# EAGLE design Noise-box-v001 (EAGLE 6.6.0)
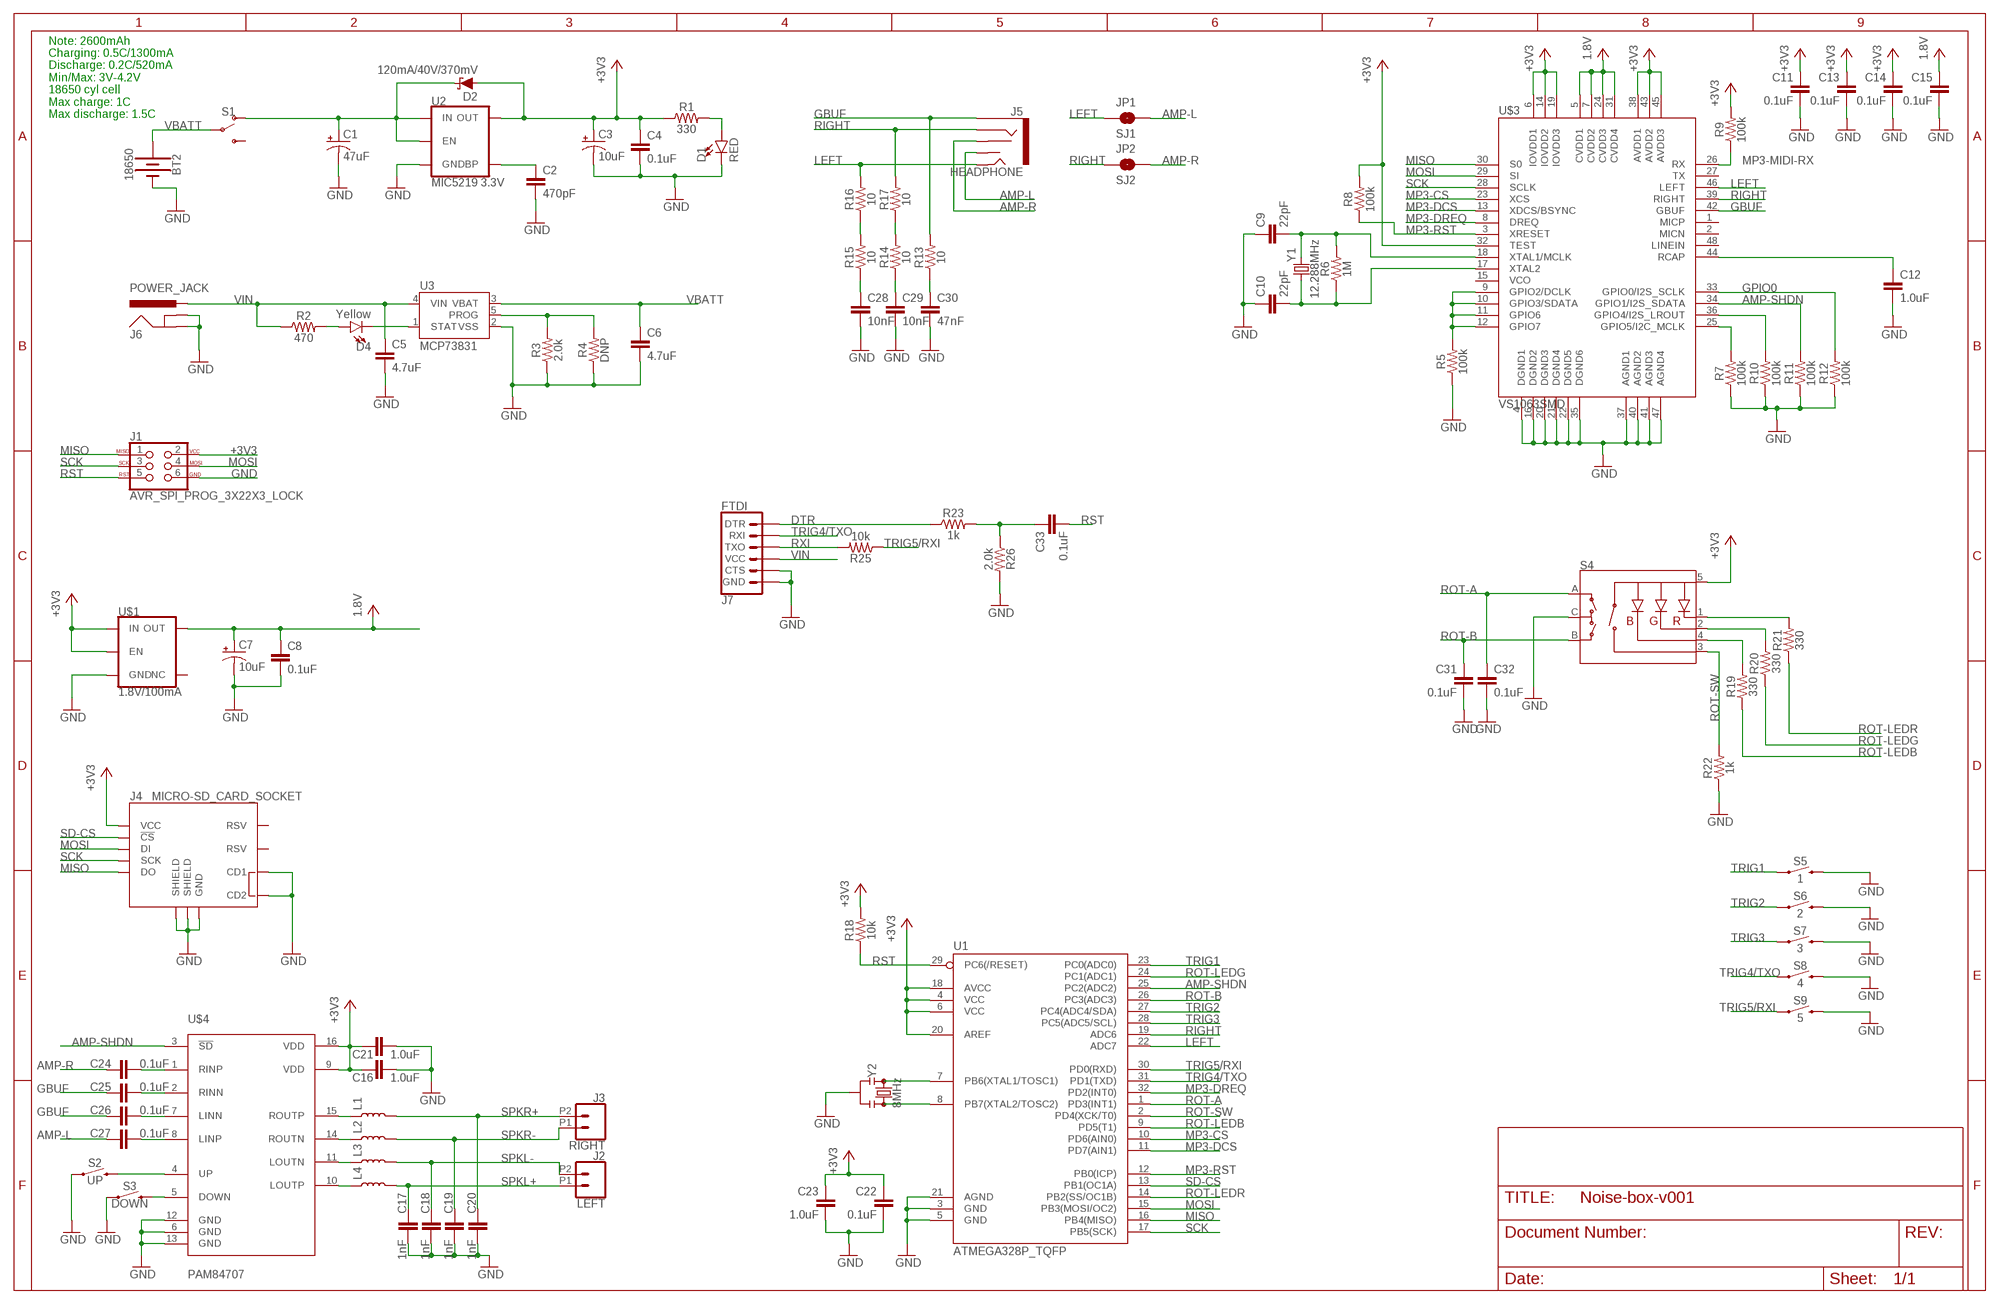
[diagram p0: schematic, sheet 1]

## Parts
BT2  18650  BATTERY-1043P  [BATTERY_18650-1043P]
C1  47uF  47UF-POLAR-EIA3528-10V-10%  [EIA3528]
C2  470pF  470PF-0603-50V-5%  [0603]
C3  10uF  10UF-POLAR-EIA3216-16V-10%(TANT)  [EIA3216]
C4  0.1uF  0.1UF-0603-25V-5%  [0603]
C5  4.7uF  4.7UF0603  [0603]
C6  4.7uF  4.7UF0603  [0603]
C7  10uF  10UF-POLAR-EIA3216-16V-10%(TANT)  [EIA3216]
C8  0.1uF  0.1UF-0603-25V-5%  [0603]
C9  22pF  22PF-0603-50V-5%  [0603]
C10  22pF  22PF-0603-50V-5%  [0603]
C11  0.1uF  0.1UF-0603-25V-5%  [0603]
C12  1.0uF  1.0UF-0603-16V-10%  [0603]
C13  0.1uF  0.1UF-0603-25V-5%  [0603]
C14  0.1uF  0.1UF-0603-25V-5%  [0603]
C15  0.1uF  0.1UF-0603-25V-5%  [0603]
C16  1.0uF  1.0UF-0603-16V-10%  [0603]
C17  1nF  1.0NF/1000PF-0603-50V-10%  [0603]
C18  1nF  1.0NF/1000PF-0603-50V-10%  [0603]
C19  1nF  1.0NF/1000PF-0603-50V-10%  [0603]
C20  1nF  1.0NF/1000PF-0603-50V-10%  [0603]
C21  1.0uF  1.0UF-0603-16V-10%  [0603]
C22  0.1uF  0.1UF-0603-25V-5%  [0603]
C23  1.0uF  1.0UF-0603-16V-10%  [0603]
C24  0.1uF  0.1UF-0603-25V-5%  [0603]
C25  0.1uF  0.1UF-0603-25V-5%  [0603]
C26  0.1uF  0.1UF-0603-25V-5%  [0603]
C27  0.1uF  0.1UF-0603-25V-5%  [0603]
C28  10nF  10NF-0603-50V-10%  [0603]
C29  10nF  10NF-0603-50V-10%  [0603]
C30  47nF  47NF-0603-25V-5%  [0603]
C31  0.1uF  0.1UF-0603-25V-5%  [0603]
C32  0.1uF  0.1UF-0603-25V-5%  [0603]
C33  0.1uF  0.1UF-0603-25V-5%  [0603]
D1  RED  LED-RED0603  [LED-0603]
D2  120mA/40V/370mV  DIODE-SCHOTTKY-RB751S40  [SOD-523]
D4  Yellow  LED-YELLOW0603  [LED-0603]
J1  AVR_SPI_PROG_3X22X3_LOCK  [2X3_LOCK]
J2  LEFT  CONN_022.54MM_SCREWTERM  [1X02_2.54_SCREWTERM]
J3  RIGHT  CONN_022.54MM_SCREWTERM  [1X02_2.54_SCREWTERM]
J4  MICRO-SD_CARD_SOCKET  [MICRO-SD-SOCKET]
J5  HEADPHONE  AUDIO_JACK_3.5MM_SMD  [AUDIO-JACK-3.5MM-SMD]
J6  POWER_JACK  [POWER_JACK_PTH]
J7  FTDI  6_PIN_SERIAL_TARGETSILK  [6_PIN_SERIAL_TARGET_SIDE_W_SILK]
JP1  SJ1  JUMPER-SMT_2_NO_SILK  [SMT-JUMPER_2_NO_SILK]
JP2  SJ2  JUMPER-SMT_2_NO_SILK  [SMT-JUMPER_2_NO_SILK]
L1  INDUCTOR-0805-3.3UH  [0805]
L2  INDUCTOR-0805-3.3UH  [0805]
L3  INDUCTOR-0805-3.3UH  [0805]
L4  INDUCTOR-0805-3.3UH  [0805]
R1  330  330OHM-0603-1/10W-1%  [0603]
R2  470  470OHM-0603-1/10W-1%  [0603]
R3  2.0k  2.0KOHM-0603-1/10W-5%  [0603]
R4  DNP  2.0KOHM-0603-1/10W-5%  [0603]
R5  100k  100KOHM-0603-1/10W-1%  [0603]
R6  1M  1MOHM-0603-1/4W-5%  [0603]
R7  100k  100KOHM-0603-1/10W-1%  [0603]
R8  100k  100KOHM-0603-1/10W-1%  [0603]
R9  100k  100KOHM-0603-1/10W-1%  [0603]
R10  100k  100KOHM-0603-1/10W-1%  [0603]
R11  100k  100KOHM-0603-1/10W-1%  [0603]
R12  100k  100KOHM-0603-1/10W-1%  [0603]
R13  10  10OHM-0603-1/10W-5%  [0603]
R14  10  10OHM-0603-1/10W-5%  [0603]
R15  10  10OHM-0603-1/10W-5%  [0603]
R16  10  10OHM-0603-1/10W-5%  [0603]
R17  10  10OHM-0603-1/10W-5%  [0603]
R18  10k  10KOHM-0603-1/10W-1%  [0603]
R19  330  330OHM-0603-1/10W-1%  [0603]
R20  330  330OHM-0603-1/10W-1%  [0603]
R21  330  330OHM-0603-1/10W-1%  [0603]
R22  1k  1KOHM-0603-1/10W-1%  [0603]
R23  1k  1KOHM-0603-1/10W-1%  [0603]
R25  10k  10KOHM-0603-1/10W-1%  [0603]
R26  2.0k  2.0KOHM-0603-1/10W-5%  [0603]
S1  SWITCH-SPDT-SMD-RIGHT-ANGLE  [SWITCH_SPST_SMD_A]
S2  UP  MOMENTARY-SWITCH-SPST-SMD-4.5MM  [TACTILE_SWITCH_SMD_4.5MM]
S3  DOWN  MOMENTARY-SWITCH-SPST-SMD-4.5MM  [TACTILE_SWITCH_SMD_4.5MM]
S4  ENCODER-RGB-SWITCH  [ENCODER_LED_3]
S5  1  MOMENTARY-SWITCH-SPST-SMD-4.5MM  [TACTILE_SWITCH_SMD_4.5MM]
S6  2  MOMENTARY-SWITCH-SPST-SMD-4.5MM  [TACTILE_SWITCH_SMD_4.5MM]
S7  3  MOMENTARY-SWITCH-SPST-SMD-4.5MM  [TACTILE_SWITCH_SMD_4.5MM]
S8  4  MOMENTARY-SWITCH-SPST-SMD-4.5MM  [TACTILE_SWITCH_SMD_4.5MM]
S9  5  MOMENTARY-SWITCH-SPST-SMD-4.5MM  [TACTILE_SWITCH_SMD_4.5MM]
U1  ATMEGA328P_TQFP  [TQFP32-08]
U2  MIC5219 3.3V  V_REG_MIC52193.3V  [SOT23-5]
U3  MCP73831  [SOT23-5]
U$1  1.8V/100mA  V_REG_SP6214-1.8V  [SC70]
U$3  VS1063SMD  [LQFP-48]
U$4  PAM84707  PAM8407  [SO16]
Y1  12.288MHz  CRYSTAL-12.288MHZ"  [CRYSTAL-SMD-5X3.2-4PAD]
Y2  8MHz  RESONATOR-8MHZSMD_3.2X1.3  [RESONATOR-SMD-3.2X1.3]

## Nets
+3V3: C3.+ C4.1 C11.1 C13.1 C14.1 C16.1 C21.1 C22.1 C23.1 D2.A J1.2 J4.VCC R1.1 R8.2 R9.2 R18.2 S4.5(+) U1.4(VCC) U1.6(VCC) U1.18(AVCC) U1.20(AREF) U2.5(OUT) U$1.1(IN) U$1.3(EN) U$3.6(IOVDD1) U$3.14(IOVDD2) U$3.19(IOVDD3) U$3.32(TEST) U$3.38(AVDD1) U$3.43(AVDD2) U$3.45(AVDD3) U$4.9(VDD) U$4.16(VDD)
AMP-L: C27.1 J5.TSH JP1.2
AMP-R: C24.1 J5.RSH JP2.2
AMP-SHDN: R11.2 U1.25(PC2(ADC2)) U$3.34(GPIO1/I2S_SDATA) U$4.3(!SD)
DTR: J7.P$1(DTR) R23.1
GBUF: C25.1 C26.1 J5.SLEEVE R13.2 U$3.42(GBUF)
GND: BT2.GND@1(-) C1.C(-) C2.2 C3.- C4.2 C5.2 C6.2 C7.- C8.2 C9.1 C10.1 C11.2 C12.2 C13.2 C14.2 C15.2 C16.2 C17.2 C18.2 C19.2 C20.2 C21.2 C22.2 C23.2 C28.2 C29.2 C30.2 C31.2 C32.2 D1.C J1.6 J4.CD1 J4.CD2 J4.GND J4.GND1(SHIELD) J4.GND3(SHIELD) J6.GND J6.GNDBREAK J7.P$5(CTS) J7.P$6(GND) R3.1 R4.1 R5.1 R7.1 R10.1 R11.1 R12.1 R22.1 R26.2 S2.2 S2.3 S3.2 S3.3 S4.C S5.1 S5.4 S6.1 S6.4 S7.1 S7.4 S8.1 S8.4 S9.1 S9.4 U1.3(GND) U1.5(GND) U1.21(AGND) U2.2(GND) U3.2(VSS) U$1.2(GND) U$3.4(DGND1) U$3.16(DGND2) U$3.20(DGND3) U$3.21(DGND4) U$3.22(DGND5) U$3.35(DGND6) U$3.37(AGND1) U$3.40(AGND2) U$3.41(AGND3) U$3.47(AGND4) U$4.6(GND) U$4.12(GND) U$4.13(GND) Y2.2
GPIO0: R12.2 U$3.33(GPIO0/I2S_SCLK)
LEFT: J5.TIP JP1.1 R16.2 U1.22(ADC7) U$3.46(LEFT)
MISO: J1.1 J4.DO U1.16(PB4(MISO)) U$3.30(S0)
MOSI: J1.4 J4.DI U1.15(PB3(MOSI/OC2)) U$3.29(SI)
MP3-CS: U1.10(PD6(AIN0)) U$3.23(XCS)
MP3-DCS: U1.11(PD7(AIN1)) U$3.13(XDCS/BSYNC)
MP3-DREQ: U1.32(PD2(INT0)) U$3.8(DREQ)
MP3-MIDI-RX: R9.1 U$3.26(RX)
MP3-RST: R8.1 U1.12(PB0(ICP)) U$3.3(XRESET)
N$1: D4.A R2.2
N$2: C2.1 U2.4(BP)
N$3: D1.A R1.2
N$4: R3.2 R4.2 U3.5(PROG)
N$5: U1.7(PB6(XTAL1/TOSC1)) Y2.1
N$6: R5.2 U$3.9(GPIO2/DCLK) U$3.10(GPIO3/SDATA) U$3.11(GPIO6) U$3.12(GPIO7)
N$7: D4.C U3.1(STAT)
N$8: U1.8(PB7(XTAL2/TOSC2)) Y2.3
N$9: L1.1 U$4.15(ROUTP)
N$10: L2.1 U$4.14(ROUTN)
N$11: L3.1 U$4.11(LOUTN)
N$12: L4.1 U$4.10(LOUTP)
N$13: C28.1 R15.1
N$14: R7.2 U$3.25(GPIO5/I2C_MCLK)
N$15: R10.2 U$3.36(GPIO4/I2S_LROUT)
N$16: C29.1 R14.1
N$17: C9.2 R6.2 U$3.18(XTAL1/MCLK) Y1.3
N$18: C10.2 R6.1 U$3.17(XTAL2) Y1.1
N$19: C30.1 R13.1
N$20: R15.2 R16.1
N$21: C12.1 U$3.44(RCAP)
N$22: R14.2 R17.1
N$24: C24.2 U$4.1(RINP)
N$26: C33.1 R23.2 R26.1
N$29: R19.2 S4.4(-B)
N$30: R20.2 S4.2(-G)
N$31: R21.2 S4.1(-R)
N$34: C25.2 U$4.2(RINN)
N$35: C26.2 U$4.7(LINN)
N$42: C27.2 U$4.8(LINP)
N$43: S3.1 S3.4 U$4.5(DOWN)
N$44: S2.1 S2.4 U$4.4(UP)
N$45: C1.A(+) D2.C S1.1(O) U2.1(IN) U2.3(EN)
RIGHT: J5.RING JP2.1 R17.2 U1.19(ADC6) U$3.39(RIGHT)
ROT-A: C32.1 S4.A U1.1(PD3(INT1))
ROT-B: C31.1 S4.B U1.26(PC3(ADC3))
ROT-LEDB: R19.1 U1.9(PD5(T1))
ROT-LEDG: R20.1 U1.24(PC1(ADC1))
ROT-LEDR: R21.1 U1.14(PB2(SS/OC1B))
ROT-SW: R22.2 S4.3(SW) U1.2(PD4(XCK/T0))
RST: C33.2 J1.5 R18.1 U1.29(PC6(/RESET))
RXI: J7.P$2(TXO) R25.2
SCK: J1.3 J4.SCLK(SCK) U1.17(PB5(SCK)) U$3.28(SCLK)
SD-CS: J4.CS(!CS) U1.13(PB1(OC1A))
SPKL+: C17.1 J2.P1 L4.2
SPKL-: C18.1 J2.P2 L3.2
SPKR+: C20.1 J3.P2 L1.2
SPKR-: C19.1 J3.P1 L2.2
TRIG1: S5.2 S5.3 U1.23(PC0(ADC0))
TRIG2: S6.2 S6.3 U1.27(PC4(ADC4/SDA))
TRIG3: S7.2 S7.3 U1.28(PC5(ADC5/SCL))
TRIG4/TXO: J7.P$3(RXI) S8.2 S8.3 U1.31(PD1(TXD))
TRIG5/RXI: R25.1 S9.2 S9.3 U1.30(PD0(RXD))
VBATT: BT2.PWR@1(+) C6.1 S1.2(P) U3.3(VBAT)
VCC: C7.+ C8.1 C15.1 U$1.5(OUT) U$3.5(CVDD1) U$3.7(CVDD2) U$3.24(CVDD3) U$3.31(CVDD4) ; supply symbol labelled 1.8V
VIN: C5.1 J6.PWR J7.P$4(VCC) R2.1 U3.4(VIN)
Unconnected: J4.RSV1(RSV) J4.RSV2(RSV) S1.3(S) U$1.4(NC) U$3.1(MICP) U$3.2(MICN) U$3.15(VCO) U$3.27(TX) U$3.48(LINEIN)

## Notes on the sheet
- Note: 2600mAh
  Charging: 0.5C/1300mA
  Discharge: 0.2C/520mA
  Min/Max: 3V-4.2V
  18650 cyl cell
  Max charge: 1C
  Max discharge: 1.5C

## Library data of the parts
BT2 = MAK:BATTERY: Battery - Single Cell A variety of battery chemistries, sizes, and footprints. Device List: 20MM_PTH - Coin Cell Battery Holder - 20mm (PTH) <https://www.sparkfun.com/products/783> 12MM_SMD - Coin Cell Battery Holder - 12mm (SMD) <https://www.sparkfun.com/products/10592> 12MM_PTH - Coin Cell Battery Holder - 12mm (PTH) <https://www.sparkfun.com/products/7948> 20MM_SMD - 20mm Coin Cell Battery Holder (SMD) (2 legs) Used on the Big Time Watch Kit <https://www.sparkfun.com/products/11734> 20MM_SMD_4LEGS - Coin Cell Battery Holder - 20mm (SMD) <https://www.sparkfun.com/products/11892> 20MM_SMD_4LEGS_OVERPASTE - Coin Cell Battery Holder - 20mm (SMD) <https://www.sparkfun.com/products/11892> (Over-paste on the legs) 24.5MM_PTH - Coin Cell Battery Holder - 24.5mm (PTH) <https://www.sparkfun.com/products/8863> 9V - 9V Battery Holder - PC Mount Used on the SparkFun SparkPunk Sound Kit <https://www.sparkfun.com/products/11177> and SparkFun SparkPunk Sequencer Kit <https://www.sparkfun.com/products/12707> 18650 - Battery Holder - 18650 (PTH) <https://www.sparkfun.com/products/13113> AA - Battery Holder - 1xAA (PTH) <https://www.sparkfun.com/products/7949> AAA - Battery Holder - 1xAAA (PTH) <https://www.sparkfun.com/products/12718> AA_KIT - Battery Holder - 1xAA (PTH) <https://www.sparkfun.com/products/7949> Special kit package - pads only have exposed copper on one side of the board. AAA_KIT - Battery Holder - 1xAAA (PTH) <https://www.sparkfun.com/products/12718> Special kit package - pads only have exposed copper on one side of the board.; MANUFACTURER: keystone electronics; PARTNO: 1043p
C1 = SparkFun-Capacitors:47UF-POLAR: 47µF polarized capacitors A capacitor is a passive two-terminal electrical component used to store electrical energy temporarily in an electric field.; PROD_ID: CAP-08310
C2 = SparkFun-Capacitors:470PF: 470pF ceramic capacitors A capacitor is a passive two-terminal electrical component used to store electrical energy temporarily in an electric field.; PROD_ID: CAP-07884
C3 C7 = SparkFun-Capacitors:10UF-POLAR: 10.0µF polarized capacitors A capacitor is a passive two-terminal electrical component used to store electrical energy temporarily in an electric field.; PROD_ID: CAP-00811
C4 C8 C11 C13-C15 C22 C24-C27 C31-C33 = SparkFun-Capacitors:0.1UF: 0.1µF ceramic capacitors A capacitor is a passive two-terminal electrical component used to store electrical energy temporarily in an electric field.; PROD_ID: CAP-08604
C5 C6 = SparkFun-Capacitors:4.7UF: 4.7µF ceramic capacitors A capacitor is a passive two-terminal electrical component used to store electrical energy temporarily in an electric field.; PROD_ID: CAP-08280
C9 C10 = SparkFun-Capacitors:22PF: 22pF ceramic capacitors A capacitor is a passive two-terminal electrical component used to store electrical energy temporarily in an electric field.; PROD_ID: CAP-07876
C12 C16 C21 C23 = SparkFun-Capacitors:1.0UF: 1µF ceramic capacitors A capacitor is a passive two-terminal electrical component used to store electrical energy temporarily in an electric field.; PROD_ID: CAP-00868
C17-C20 = SparkFun-Capacitors:1.0NF/1000PF: 1nF/1,000pF ceramic capacitors A capacitor is a passive two-terminal electrical component used to store electrical energy temporarily in an electric field.; PROD_ID: CAP-07886
C28 C29 = SparkFun-Capacitors:10NF: 0.01uF/10nF/10,000pF ceramic capacitors A capacitor is a passive two-terminal electrical component used to store electrical energy temporarily in an electric field. CAP-09321; PROD_ID: CAP-00867
C30 = SparkFun-Capacitors:47NF: 47nF ceramic capacitors A capacitor is a passive two-terminal electrical component used to store electrical energy temporarily in an electric field.; PROD_ID: CAP-08605
D1 = SparkFun-LED:LED-RED: Red SMD LED Used in manufacturing of most products at SparkFun Packages: 0603 - SMD 0603 package [Product Link] <http://docs.avagotech.com/docs/AV02-0551EN> 0603 SMART - SMD 0603 SMART package ( more efficient and expensive)[Product Link] <http://www.osram-os.com/Graphics/XPic2/00077099_0.pdf> 1206 - SMD1206 package [Product Link] <https://www.sparkfun.com/datasheets/DevTools/LilyPad/Q150OVS4.pdff> SparkFun Products: Pro Mini 328 -5V <https://www.sparkfun.com/products/821> RedBoard <https://www.sparkfun.com/products/12757> IOIO-OTG <https://www.sparkfun.com/products/13613>; PROD_ID: DIO-00819
D2 = SparkFun-DiscreteSemi:DIODE-SCHOTTKY: Schottky diode A Schottky diode is a semiconductor diode which has a low forward voltage drop and a very fast switching action.; PROD_ID: DIO-11018
D4 = SparkFun-LED:LED-YELLOW: Yellow SMD LED Used in manufacturing several products at SparkFun. Packages: 0603 - SMD 0603 package[Product Link] <http://www.kingbrightusa.com/product.asp?catalog_name=LED&product_id=APT1608SYCK> 0603 -SMART - SMART SMD 0603 package (more efficient/more expensive) [Product Link] <http://www.osram-os.com/osram_os/en/products/product-catalog/led-light-emitting-diodes/smartled-0603/ly-l29k/index.jsp> LilyPad - SMD1206 package[Product Datasheet] <https://www.sparkfun.com/datasheets/DevTools/LilyPad/Q150YUS4.pdf> SparkFun Products: Blynk Board <https://www.sparkfun.com/products/13794> IOIO-OTG <https://www.sparkfun.com/products/13613> XBee Explorer Serial <https://www.sparkfun.com/products/13225>; PROD_ID: DIO-09003
J1 = SparkFun-Connectors:AVR_SPI_PROG_3X2: AVR ISP 6 Pin This is the reduced ISP connector for AVR programming. Common on Arduino. This footprint will take up less PCB space and can be used with a 10-pin to 6-pin adapter such as SKU: BOB-08508 **Special note about "TEST_POINT" package. The stop mask is on the top side, so if you want your programming test points to be on the bottom of your board, make sure to place this package on the bottom side of the board. This also ensure that the orientation to program from the bottom side will be correct. SparkFun Products: SparkFun ISP Pogo Adapter <https://www.sparkfun.com/products/11591> - NS Tiny AVR Programmer <https://www.sparkfun.com/products/11801> -PTH
J2 J3 = SparkFun-Connectors:CONN_02: Multi connection point. Often used as Generic Header-pin footprint for 0.1 inch spaced/style header connections On any of the 0.1 inch spaced packages, you can populate with these: Break Away Headers - Straight <https://www.sparkfun.com/products/116> (PRT-00116) Break Away Male Headers - Right Angle <https://www.sparkfun.com/products/553> (PRT-00553) Female Headers <https://www.sparkfun.com/products/115> (PRT-00115) Break Away Headers - Machine Pin <https://www.sparkfun.com/products/117> (PRT-00117) Break Away Female Headers - Swiss Machine Pin <https://www.sparkfun.com/products/743> (PRT-00743) For SCREWTERMINALS and SPRING TERMINALS visit here: Screw Terimnals on SparkFun.com <https://www.sparkfun.com/search/results?term=Screw+Terminals> (5mm/3.5mm/2.54mm spacing) This device is also useful as a general connection point to wire up your design to another part of your project. Our various solder wires solder well into these plated through hole pads. Hook-Up Wire - Assortment (Stranded, 22 AWG) <https://www.sparkfun.com/products/11375> (PRT-11375) Hook-Up Wire - Assortment (Solid Core, 22 AWG) <https://www.sparkfun.com/products/11367> (PRT-11367) View the entire wire category on our website here <https://www.sparkfun.com/categories/141> Special notes: Molex polarized connector foot print use with: PRT-08233 with associated crimp pins and housings. 2.54_SCREWTERM for use with PRT-10571. 3.5mm Screw Terminal footprints for PRT-08084 5mm Screw Terminal footprints for use with PRT-08432
J4 = SparkFun-Connectors:MICRO-SD_CARD_SOCKET: microSD Socket for Transflash Push-push type µSD socket. tDoc lines correctly indicate media card edge positions when inserting (unlocked, locked, depressed). NOTE: CD1 and CD2 are connected internally, and the default detect state of the socket is detect pin to ground. SparkFun Products: WAV Trigger <https://www.sparkfun.com/products/13660> CAN-Bus Shield <https://www.sparkfun.com/products/13262> SparkFun Level Shifing microSD Breakout <https://www.sparkfun.com/products/13743>; PROD_ID: CONN-07820; SF_ID: PRT-00127
J5 = SparkFun-Connectors:AUDIO_JACK_3.5MM: Audio Jack 3.5mm variants of PTH and SMT stereo audio jack with bypass switches. SparkFun Products: SparkFun SparkPunk Sound Kit <[https://www.sparkfun.com/products/11177]> - PTH MP3 Trigger <https://www.sparkfun.com/products/13720> -3.5mm SMD SparkFun PicoBoard <https://www.sparkfun.com/products/11888>- 2.5mm SMD; PROD_ID: CONN-10353
J6 = SparkFun-Connectors:POWER_JACK: Power Jack Connector This is the standard 5.5mm barrel jack for power. The PTH is the most common, proven, reliable, footprint. The Slot footprint only works if the mill layer is transmitted to the PCB fab house so be warned. Here are the connectors we sell at SparkFun: DC Barrel Power Jack/Connector <https://www.sparkfun.com/products/119> (PRT-00119) DC Barrel Power Jack/Connector (SMD) <https://www.sparkfun.com/products/12748> (PRT-12748) DC Barrel Jack Adapter - Breadboard Compatible <https://www.sparkfun.com/products/10811> (PRT-10811) It is used on this SparkFun product (and many, many others): SparkFun RedBoard - Programmed with Arduino <https://www.sparkfun.com/products/12757> (DEV-12757) Also, if you need a mating power supply or connector, please check these out: Wall Adapter Power Supply - 9VDC 650mA <https://www.sparkfun.com/products/298> (TOL-00298) DC Barrel Jack Adapter - Male <https://www.sparkfun.com/products/10287> (PRT-10287); PROD_ID: CONN-08197
J7 = SparkFun-Connectors:6_PIN_SERIAL_TARGET: 6-pin header connection for use with the "FTDI BASIC" pinout - TARGET SIDE. Also known as "Arduino Serial Program Header". It is used to mate with our FTDI Basic serial programmers using the Arduino IDE. Note, this device has "TARGET" in the name. It is intended to be used on a design that contains a target micro-controller that you wish to program. The "sister" device, named "CABLE" is inteneded to be used on a design that usually lives on the end of your USB cable and prvides the converter chip (FTDI232 or FTDI231x) to commnicate serial RX/TX. You can populate with some of these: Break Away Headers - Straight <https://www.sparkfun.com/products/116> (PRT-00116) For reference (or to suit your programming needs) check out these designs: SparkFun FTDI Basic Breakout - 5V <https://www.sparkfun.com/products/9716> (DEV-09716) SparkFun FTDI Basic Breakout - 3.3V <https://www.sparkfun.com/products/9873> (DEV-09873) SparkFun FTDI SmartBasic <https://www.sparkfun.com/products/12935> (DEV-12935) SparkFun Beefy 3 - FTDI Basic Breakout <https://www.sparkfun.com/products/13746> (DEV-13746)
JP1 JP2 = SparkFun-Jumpers:JUMPER-SMT_2_NO: Normally open jumper This jumper has two pads in close proximity to each other. Apply solder to close the connection. Round pads are easier to solder for beginners, but are a lot larger. SparkFun Product that uses the round pads: SparkFun EL Sequencer <https://www.sparkfun.com/products/12781>
L1-L4 = SparkFun-Coils:INDUCTOR: Inductors Resist changes in electrical current. Basically a coil of wire. SparkFun Products: SparkFun Load Cell Amplifier - HX711 <https://www.sparkfun.com/products/13879> IOIO-OTG - V2.2 <https://www.sparkfun.com/products/13613>; PROD_ID: NDUC-13076; VALUE: 3.3µH/±20%/450mA
R1 R19-R21 = SparkFun-Resistors:330OHM: 330Ω resistor A resistor is a passive two-terminal electrical component that implements electrical resistance as a circuit element. Resistors act to reduce current flow, and, at the same time, act to lower voltage levels within circuits. - Wikipedia; PROD_ID: RES-00818
R2 = SparkFun-Resistors:470OHM: 470Ω resistor A resistor is a passive two-terminal electrical component that implements electrical resistance as a circuit element. Resistors act to reduce current flow, and, at the same time, act to lower voltage levels within circuits. - Wikipedia; PROD_ID: RES-07869
R3 R26 = SparkFun-Resistors:2.0KOHM: 2kΩ resistor A resistor is a passive two-terminal electrical component that implements electrical resistance as a circuit element. Resistors act to reduce current flow, and, at the same time, act to lower voltage levels within circuits. - Wikipedia; PROD_ID: RES-08296
R4 = SparkFun-Resistors:2.0KOHM: 2kΩ resistor A resistor is a passive two-terminal electrical component that implements electrical resistance as a circuit element. Resistors act to reduce current flow, and, at the same time, act to lower voltage levels within circuits. - Wikipedia; PROD_ID: RES-08296; VALUE: 2.0k
R5 R7-R12 = SparkFun-Resistors:100KOHM: 100kΩ resistor A resistor is a passive two-terminal electrical component that implements electrical resistance as a circuit element. Resistors act to reduce current flow, and, at the same time, act to lower voltage levels within circuits. - Wikipedia; PROD_ID: RES-07828
R6 = SparkFun-Resistors:1MOHM: 1MΩ resistor A resistor is a passive two-terminal electrical component that implements electrical resistance as a circuit element. Resistors act to reduce current flow, and, at the same time, act to lower voltage levels within circuits. - Wikipedia; PROD_ID: RES-07868
R13-R17 = SparkFun-Resistors:10OHM: 10Ω resistor A resistor is a passive two-terminal electrical component that implements electrical resistance as a circuit element. Resistors act to reduce current flow, and, at the same time, act to lower voltage levels within circuits. - Wikipedia; PROD_ID: RES-09834
R18 R25 = SparkFun-Resistors:10KOHM: 10kΩ resistor A resistor is a passive two-terminal electrical component that implements electrical resistance as a circuit element. Resistors act to reduce current flow, and, at the same time, act to lower voltage levels within circuits. - Wikipedia; PROD_ID: RES-00824
R22 R23 = SparkFun-Resistors:1KOHM: 1kΩ resistor A resistor is a passive two-terminal electrical component that implements electrical resistance as a circuit element. Resistors act to reduce current flow, and, at the same time, act to lower voltage levels within circuits. - Wikipedia; PROD_ID: RES-07856
S1 = SparkFun-Switches:SWITCH-SPDT: Single Pole, Double Throw (SPDT) Switch Single-pole, double-throw (SPDT) switch. Variant Overview SMD-AYZ0202 Surface Mount DPDT Switch <https://www.sparkfun.com/products/597> (COM-00597) Used on e.g. LilyPad Arduino USB - ATmega32U4 Board <https://www.sparkfun.com/products/12049> PTH-11.6X4.0MM SPDT Mini Power Switch <https://www.sparkfun.com/products/102> (COM-00102) Used on e.g. SparkFun Simon Says - Through-Hole Soldering Kit <https://www.sparkfun.com/products/10547> (KIT-10547) PTH-11.6X4.0MM-KIT KIT version of SPDT Mini Power Switch - Simplifies soldering by removing tStop of switch pins - only one side can be soldered. PTH-11.6X4.0MM-LOCK LOCK version of SPDT Mini Power Switch - Offset pins hold switch in place for easier soldering. SMD-RIGHT-ANGLE Surface Mount Right Angle Switch <https://www.sparkfun.com/products/10860> (COM-10860) Used on e.g. SparkFun ESP8266 Thing <https://www.sparkfun.com/products/13231>; PROD_ID: SWCH-10651; SF_SKU: COM-10860
S2 S3 S5-S9 = SparkFun-Switches:MOMENTARY-SWITCH-SPST: Momentary Switch (Pushbutton) - SPST Normally-open (NO) SPST momentary switches (buttons, pushbuttons). Variants PTH-12MM - 12mm square, through-hole Momentary Pushbutton Switch - 12mm Square <https://www.sparkfun.com/products/9190> (COM-09190) PTH-6.0MM, PTH-6.0MM-KIT - 6.0mm square, through-hole Mini Pushbutton Switch <https://www.sparkfun.com/products/97> (COM-00097) KIT package intended for soldering kit's - only one side of pads' copper is exposed. PTH-RIGHT-ANGLE-KIT - Right-angle, through-hole Right Angle Tactile Button <https://www.sparkfun.com/products/10791> - Used on SparkFun BigTime Watch Kit <https://www.sparkfun.com/products/11734> SMD-12MM - 12mm square, surface-mount Tactile Button - SMD (12mm) <https://www.sparkfun.com/products/12993> (COM-12993) Used on SparkFun PicoBoard <https://www.sparkfun.com/products/11888> SMD-4.5MM - 4.5mm Square Trackball Switch Used on SparkFun Blackberry Trackballer Breakout <https://www.sparkfun.com/products/13169> SMD-4.6MMX2.8MM - 4.60mm x 2.80mm, surface mount Used on SparkFun SAMD21 Mini Breakout <https://www.sparkfun.com/products/13664> SMD-5.2MM, SMD-5.2-REDUNDANT - 5.2mm square, surface-mount Mini Pushbutton Switch - SMD <https://www.sparkfun.com/products/8720> (COM-08720) Used on Arduino Pro Mini <https://www.sparkfun.com/products/11114> REDUNDANT package connects both switch circuits together SMD-6.0X3.5MM - 6.0 x 3.5mm, surface mount Momentary Reset Switch SMD <https://www.sparkfun.com/products/8229> (COM-08229) SMD-6.2MM-TALL - 6.2mm square, surface mount Tactile Button - SMD (6mm) <https://www.sparkfun.com/products/12992> Used on SparkFun Digital Sandbox <https://www.sparkfun.com/products/12651> SMD-RIGHT-ANGLE - Right-angle, surface mount Used on SparkFun Block for Intel® Edison - Arduino <https://www.sparkfun.com/products/13036>; PROD_ID: SWCH-09213
S4 = SparkFun-Switches:ENCODER-RGB-SWITCH: Illuminated Rotary Encoder w/ RGB LED and select switch Encoders rotate similarly to potentiometers, but they’re different from potentiometers in that an encoder has full rotation without limits. They output gray code so that you can tell how much and in which direction the encoder has been turned. This encoder includes an RGB LED and a push-down select switch. Part #: Top Up EC12PLRGBSDVBF-D <http://top-up.so-buy.com/front/bin/ptdetail.phtml?Part=EC12PLRGBSDVBF-D> SparkFun Products Rotary Encoder - Illuminated (RGB) <https://www.sparkfun.com/products/10982> (COM-10982); PROD_ID: RES-10859; SF_SKU: COM-10982
U1 = SparkFun-IC-Microcontroller:ATMEGA328P_TQFP: Popular 328P in QFP Storefront component: ATmega328 - TQFP <https://www.sparkfun.com/products/13448> (COM-13448) Datasheet <http://www.sparkfun.com/datasheets/Components/SMD/ATMega328.pdf> SparkFun Products SparkFun RedBoard - Programmed with Arduino <https://www.sparkfun.com/products/12757> (DEV-12757) Arduino Pro Mini 328 - 5V/16MHz <https://www.sparkfun.com/products/11113> (DEV-11113) Arduino Pro Mini 328 - 3.3V/8MHz <https://www.sparkfun.com/products/11114> (DEV-11114) SparkFun OpenLog <https://www.sparkfun.com/products/13712> (DEV-13712) SparkFun MicroView - OLED Arduino Module <https://www.sparkfun.com/products/12923> (DEV-12923) SparkFun Digital Sandbox <https://www.sparkfun.com/products/12651> (DEV-12651) SparkFun PicoBoard <https://www.sparkfun.com/products/11888> (WIG-11888) Arduino Fio <https://www.sparkfun.com/products/10116> (DEV-10116) LilyPad Arduino 328 Main Board <https://www.sparkfun.com/products/13342> (DEV-13342) SparkFun RedStick <https://www.sparkfun.com/products/13741> (DEV-13741) LilyPad MP3 <https://www.sparkfun.com/products/11013> (DEV-11013) LilyPad Arduino SimpleSnap <https://www.sparkfun.com/products/10941> (DEV-10941) SparkFun Stepoko <https://www.sparkfun.com/products/13899> (ROB-13899) SparkFun Geiger Counter <https://www.sparkfun.com/products/11345> (SEN-11345) SparkFun EL Sequencer <https://www.sparkfun.com/products/12781> (COM-12781) Arduino Pro 328 - 5V/16MHz <https://www.sparkfun.com/products/10915> (DEV-10915) CryptoCape <https://www.sparkfun.com/products/12773> (DEV-12773) SparkFun IR Thermometer Evaluation Board - MLX90614 <https://www.sparkfun.com/products/10740> (SEN-10740) SparkFun RedBot Mainboard <https://www.sparkfun.com/products/12097> (ROB-12097) Arduino Pro 328 - 3.3V/8MHz <https://www.sparkfun.com/products/10914> (DEV-10914) SparkFun Block for Intel® Edison - Arduino <https://www.sparkfun.com/products/13036> (DEV-13036) SparkFun Simon Says - Surface Mount Soldering Kit <https://www.sparkfun.com/products/10935> (KIT-10935) SparkFun 7-Segment Serial Display - Red <https://www.sparkfun.com/products/11441> (COM-11441) SparkFun 7-Segment Serial Display - White <https://www.sparkfun.com/products/11629> (COM-11629) SparkFun 7-Segment Serial Display - Yellow <https://www.sparkfun.com/products/11443> (COM-11443) SparkFun 7-Segment Serial Display - Kelly Green <https://www.sparkfun.com/products/11440> (COM-11440) SparkFun 7-Segment Serial Display - Blue <https://www.sparkfun.com/products/11442> (COM-11442) SparkFun OpenSegment Serial Display - 20mm (Blue) <https://www.sparkfun.com/products/11647> (COM-11647) SparkFun OpenSegment Serial Display - 20mm (Green) <https://www.sparkfun.com/products/11646> (COM-11646) SparkFun OpenSegment Serial Display - 20mm (White) <https://www.sparkfun.com/products/11648> (COM-11648) SparkFun OpenSegment Serial Display - 20mm (Red) <https://www.sparkfun.com/products/11644> (COM-11644) SparkFun OpenSegment Serial Display - 20mm (Yellow) <https://www.sparkfun.com/products/11645> (COM-11645) SparkFun OpenSegment Shield <https://www.sparkfun.com/products/13190> (DEV-13190); PROD_ID: IC-09069
U2 = SparkFun-IC-Power:V_REG_MIC5219: V_REG MIC5219 Standard 3.3V and 5V 500mA LDO voltage regulator in SOT-23 layout. Micrel part MIC5219. BP (by-pass) pin is used to lower output noise with 470pF cap, may be left open.; PROD_ID: VREG-09872
U3 = SparkFun-IC-Power:MCP73831: MCP73831T Li-Ion, Li-Pol Controller Miniature single cell, fully integrated Li-Ion, Li-polymer charge management controller Datasheet <http://ww1.microchip.com/downloads/en/DeviceDoc/20001984g.pdf> SparkFun Products: SparkFun ESP32 Thing <https://www.sparkfun.com/products/13907> SparkFun 9DoF Razor IMU M0 <https://www.sparkfun.com/products/14001>; PROD_ID: IC-09995
U$1 = SparkFun-IC-Power:V_REG_SP6214: Voltage Regulator - SP6214 SP6214 Series SC-70-5 Micropower SC-70 100 mA CMOS LDO Regulator Datasheet <https://www.exar.com/content/document.ashx?id=654> SparkFun Products: MP3 Trigger <https://www.sparkfun.com/products/13720> SparkFun Particle Sensor Breakout <https://www.sparkfun.com/products/14045>; PROD_ID: VREG-08428
U$3 = SparkFun-IC-Conversion:VS1063: MP3 and MIDI Codec - VS1063 AAC/MP3/WMA/MIDI/Ogg Audio Player and Ogg Recording Device LQFP-48 7x7x1.4 mm Datasheet <http://cdn.sparkfun.com/datasheets/Widgets/vs1063ds.pdf> SparkFun Products Storefront component: MP3 and MIDI Codec - VS1063 <https://www.sparkfun.com/products/11025> (COM-11025); PROD_ID: IC-10870
U$4 = RJC:PAM8407; PARTNO: PAM8407DRDICT-ND
Y1 = SparkFun-Clocks:CRYSTAL-12.288MHZ: 12.288MHz Crystal Digikey Example <http://www.digikey.com/product-detail/en/abracon-llc/ABM3B-12.288MHZ-B2-T/535-9117-1-ND/675634> Frequency: 12.288MHz Frequency Stability: ±50ppm Frequency Tolerance: ±20ppm Load Capacitance: 18pF SparkFun Products: MP3 Trigger <https://www.sparkfun.com/products/13720> SparkFun MP3 Player Shield <https://www.sparkfun.com/products/12660>; PROD_ID: XTAL-09653
Y2 = SparkFun-Clocks:RESONATOR-8MHZ: 8MHz Resonator Digikey Example <http://www.digikey.com/product-detail/en/murata-electronics-north-america/CSTCE10M0G55-R0/490-1196-1-ND/584633> Frequency: 8MHz Frequency Stability: ±0.2% Frequency Tolerance: ±0.5% Capacitance: 33pF SparkFun Products Arduino Pro Mini 328- 3.3V/8MHz <https://www.sparkfun.com/products/11114> SparkFun Digital Sandbox <https://www.sparkfun.com/products/12651>; PROD_ID: XTAL-08895

## Board
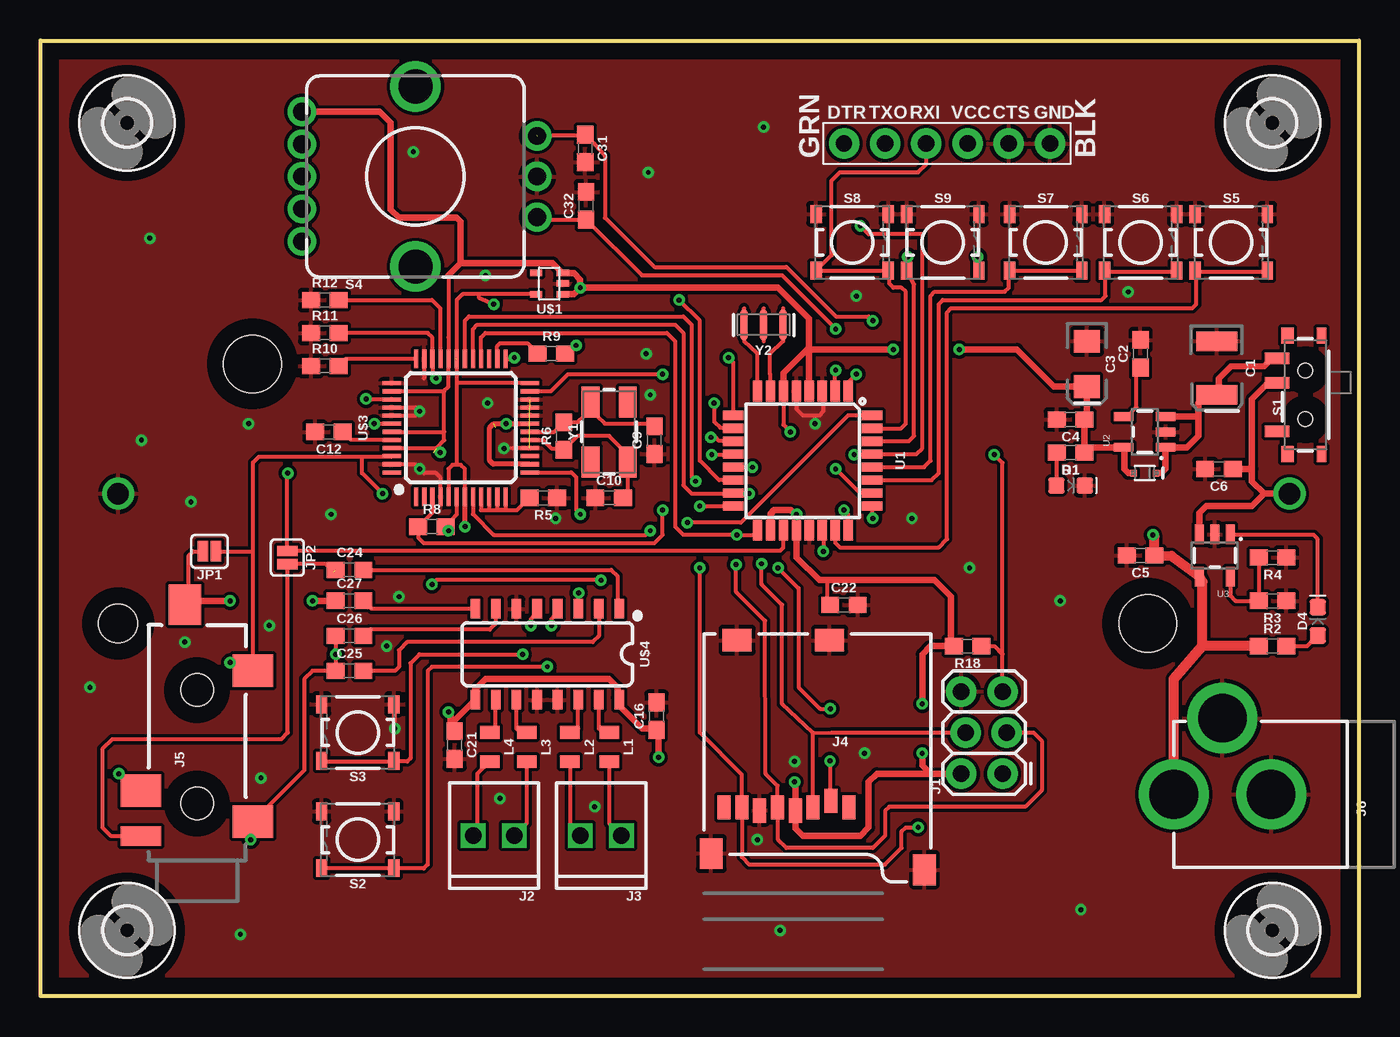
[diagram p1: board, top side]
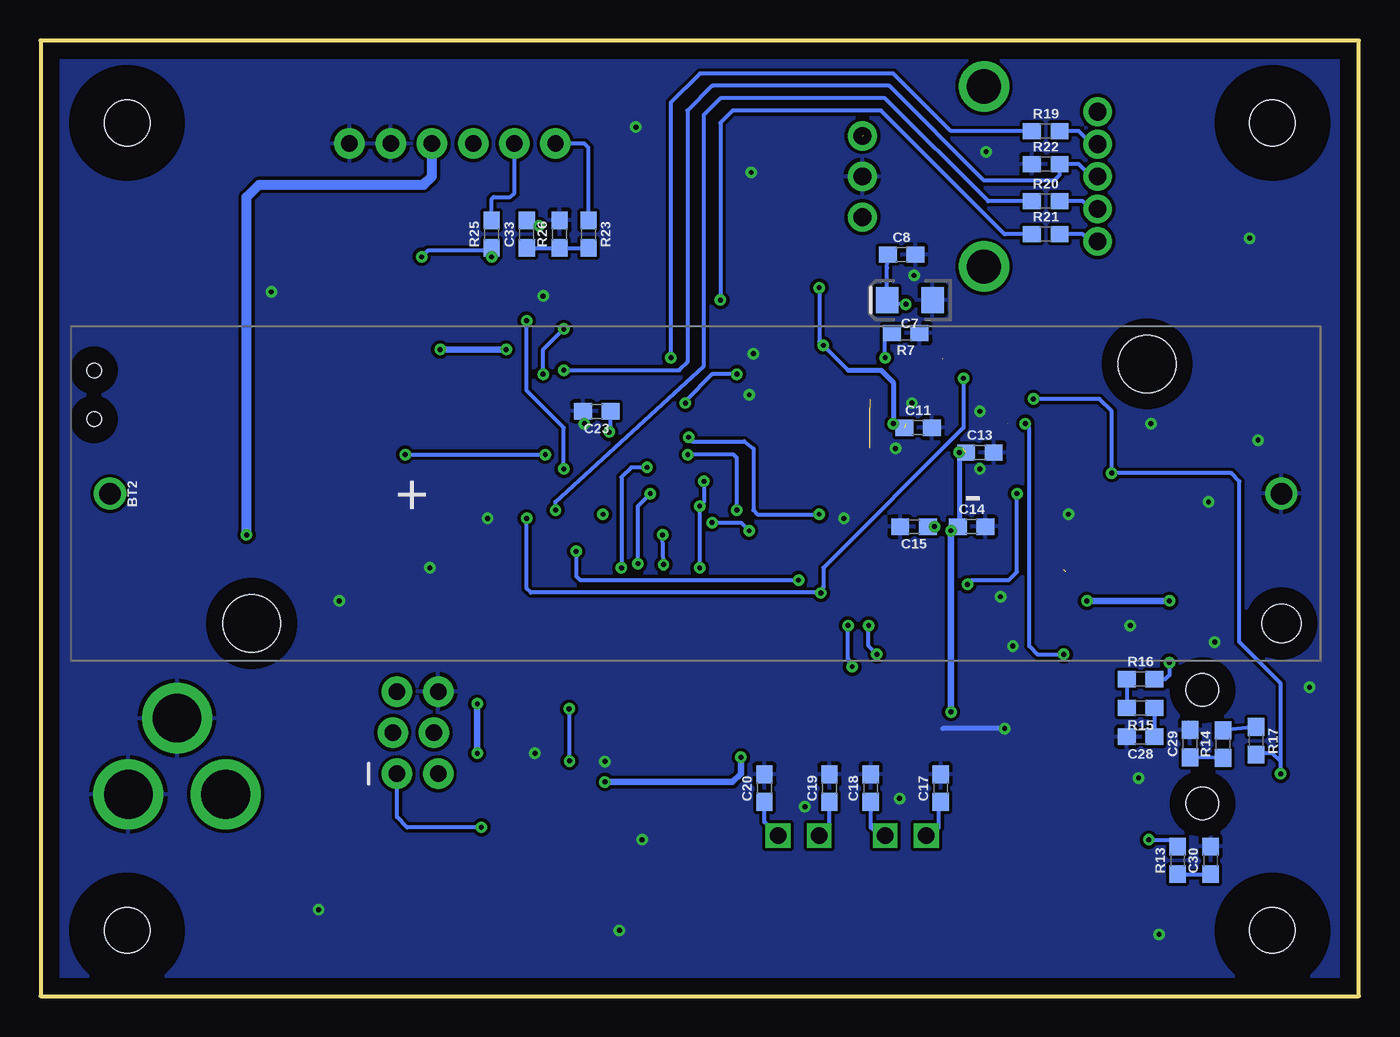
[diagram p2: board, bottom side, seen from below]

Size 81.28 x 58.93 mm. Coordinates in mm from the lower left corner, seen from the top.
Outline: 0,58.93 81.28,58.93 81.28,0 0,0 0,58.93
Copper layers (1*16): Top 0.035mm / dielectric 1.5mm / Bottom 0.035mm
Design rules "default": minimum track width 10mil, minimum drill 24mil, track to track 8mil, track to pad 8mil, pad to pad 8mil, via to via 8mil, smd to smd 8mil, copper to edge 40mil, drill to drill 8mil, minimum pad ring 10mil, minimum via ring 8mil, stop-mask expansion 4mil, vias tented up to drill 0mil, thermal gap 10mil

### Footprints (pad centres in the part's own frame; a part is rotated, then mirrored left to right if it is on the bottom)
BATTERY_18650-1043P = drill 1.32: GND@1 36.11,0; PWR@1 -36.11,0 | hole 3.55: -27.37,-8; 27.83,8 | hole 2.39: 36.11,-8
EIA3528 = smd 1.2 x 2.5: A 1.65,0; C -1.65,0
0603 = smd 1.1 x 1: 1 -0.85,0; 2 0.85,0
EIA3216 = smd 1.4 x 1.6: + 1.4,0; - -1.4,0
LED-0603 = smd 1 x 1: A -0.877,0; C 0.877,0
SOD-523 = smd 0.4 x 0.4: A -0.7,0; C 0.7,0
2X3_LOCK = drill 1.016 pad 1.88: 1 0,0.127; 2 0,2.667; 3 2.54,-0.127; 4 2.54,2.413; 5 5.08,0.127; 6 5.08,2.667
1X02_2.54_SCREWTERM = drill 1.016 square: P1 2.54,0; P2 0,0
MICRO-SD-SOCKET = smd 1.8 x 1.4: CD1 -2.05,0.4; CD2 -7.75,0.4 | smd 0.8 x 1.5: CS -7.84,10.3; DI -6.74,10.7; DO -2.34,10.7; GND -3.44,10.9; RSV1 -8.94,10.7; RSV2 -1.24,10.7; SCLK -4.54,10.7; VCC -5.64,10.9 | smd 1.4 x 1.9: GND1 -13.6,14.55; GND3 -0.45,13.55
AUDIO-JACK-3.5MM-SMD = smd 2 x 2.5: RING 4.3,3.45; SLEEVE 2.4,-3.45; TIP 11.7,-3.45 | smd 1.2 x 2.5: RSH 1.5,3.45 | smd 2.5 x 2: TSH 15.75,0.75 | hole 2: 3.5,0; 10.5,0
POWER_JACK_PTH = drill 2.997 pad 4.318: GND 0,7.7; GNDBREAK 4.7,10.7; PWR 0,13.7
6_PIN_SERIAL_TARGET_SIDE_W_SILK = drill 1.016 pad 1.88: P$1 -6.35,0; P$2 -3.81,0; P$3 -1.27,0; P$4 1.27,0; P$5 3.81,0; P$6 6.35,0
SMT-JUMPER_2_NO_SILK = smd 0.635 x 1.27: 1 -0.406,0; 2 0.406,0
0805 = smd 0.8 x 1.2: 1 -0.9,0; 2 0.9,0
SWITCH_SPST_SMD_A = smd 0.7 x 1.5: 1 -2.25,-1.75; 2 -0.75,-1.75; 3 2.25,-1.75 | smd 1 x 0.6: GND1 -3.65,1; GND3 3.65,1 | smd 1 x 0.8: GND2 -3.65,-1.1; GND4 3.65,-1.1 | hole 0.9: -1.5,0; 1.5,0
TACTILE_SWITCH_SMD_4.5MM = smd 0.7 x 1.1: 1 2.225,1.75; 2 2.225,-1.75; 3 -2.225,-1.75; 4 -2.225,1.75
ENCODER_LED_3 = drill 1.1 pad 1.778: 1 -4,7; 2 -2,7; 3 0,7; 4 2,7; 5 4,7 | drill 1.1 pad 1.8: A -2.5,-7.5; B 2.5,-7.5; C 0,-7.5 | drill 2.1: M1 -5.55,0; M2 5.55,0
TQFP32-08 = smd 1.27 x 0.559: 1 -4.293,2.8; 2 -4.293,2; 3 -4.293,1.2; 4 -4.293,0.4; 5 -4.293,-0.4; 6 -4.293,-1.2; 7 -4.293,-2; 8 -4.293,-2.8; 17 4.293,-2.8; 18 4.293,-2; 19 4.293,-1.2; 20 4.293,-0.4; 21 4.293,0.4; 22 4.293,1.2; 23 4.293,2; 24 4.293,2.8 | smd 0.559 x 1.27: 9 -2.8,-4.293; 10 -2,-4.293; 11 -1.2,-4.293; 12 -0.4,-4.293; 13 0.4,-4.293; 14 1.2,-4.293; 15 2,-4.293; 16 2.8,-4.293; 25 2.8,4.293; 26 2,4.293; 27 1.2,4.293; 28 0.4,4.293; 29 -0.4,4.293; 30 -1.2,4.293; 31 -2,4.293; 32 -2.8,4.293
SOT23-5 = smd 0.55 x 1.2: 1 -0.95,-1.3; 2 0,-1.3; 3 0.95,-1.3; 4 0.95,1.3; 5 -0.95,1.3
SC70 = smd 0.4 x 0.75: 1 -0.65,-0.825; 2 0,-0.825; 3 0.65,-0.825; 4 0.65,0.825; 5 -0.65,0.825
2,8 = hole 2.8: 0,0
LQFP-48 = smd 0.254 x 1.143: 1 -2.75,-4.25; 2 -2.25,-4.25; 3 -1.75,-4.25; 4 -1.25,-4.25; 5 -0.75,-4.25; 6 -0.25,-4.25; 7 0.25,-4.25; 8 0.75,-4.25; 9 1.25,-4.25; 10 1.75,-4.25; 11 2.25,-4.25; 12 2.75,-4.25; 25 2.75,4.25; 26 2.25,4.25; 27 1.75,4.25; 28 1.25,4.25; 29 0.75,4.25; 30 0.25,4.25; 31 -0.25,4.25; 32 -0.75,4.25; 33 -1.25,4.25; 34 -1.75,4.25; 35 -2.25,4.25; 36 -2.75,4.25 | smd 1.143 x 0.254: 13 4.25,-2.75; 14 4.25,-2.25; 15 4.25,-1.75; 16 4.25,-1.25; 17 4.25,-0.75; 18 4.25,-0.25; 19 4.25,0.25; 20 4.25,0.75; 21 4.25,1.25; 22 4.25,1.75; 23 4.25,2.25; 24 4.25,2.75; 37 -4.25,2.75; 38 -4.25,2.25; 39 -4.25,1.75; 40 -4.25,1.25; 41 -4.25,0.75; 42 -4.25,0.25; 43 -4.25,-0.25; 44 -4.25,-0.75; 45 -4.25,-1.25; 46 -4.25,-1.75; 47 -4.25,-2.25; 48 -4.25,-2.75
SO16 = smd 0.6 x 1.2: 1 -4.445,-2.8; 2 -3.175,-2.8; 3 -1.905,-2.8; 4 -0.635,-2.8; 5 0.635,-2.8; 6 1.905,-2.8; 7 3.175,-2.8; 8 4.445,-2.8; 9 4.445,2.8; 10 3.175,2.8; 11 1.905,2.8; 12 0.635,2.8; 13 -0.635,2.8; 14 -1.905,2.8; 15 -3.175,2.8; 16 -4.445,2.8
CRYSTAL-SMD-5X3.2-4PAD = smd 1.9 x 1.1: 1 -1.85,-1.15; 2 1.85,-1.15; 3 1.85,1.15; 4 -1.85,1.15
RESONATOR-SMD-3.2X1.3 = smd 0.45 x 1.905: 1 -1.2,0; 2 0,0; 3 1.2,0

### Placement (x,y rotation side)
BT2  40.89,30.99 0 bottom
C1  72.52,38.73 270 top
C2  67.82,39.62 90 top
C3  64.52,38.99 270 top
C4  63.5,35.56 180 top
C5  67.82,27.18 180 top
C6  72.64,32.51 180 top
C7  27.69,42.93 180 bottom
C8  28.19,45.72 0 bottom
C9  37.85,34.29 90 top
C10  35.05,30.73 0 top
C11  27.18,35.05 0 bottom
C12  17.78,34.8 180 top
C13  23.37,33.53 0 bottom
C14  23.88,28.96 0 bottom
C15  27.43,28.96 180 bottom
C16  37.97,17.27 90 top
C17  25.78,12.83 90 bottom
C18  30.1,12.83 90 bottom
C19  32.64,12.83 90 bottom
C20  36.65,12.83 90 bottom
C21  25.53,15.49 270 top
C22  49.53,24.13 0 top
C23  46.99,36.07 180 bottom
C24  19.05,26.29 0 top
C25  19.05,20.07 0 top
C26  19.05,22.23 0 top
C27  19.05,24.38 0 top
C28  13.46,16 180 bottom
C29  10.41,15.57 90 bottom
C30  9.14,8.38 90 bottom
C31  33.58,52.27 270 top
C32  33.63,48.74 90 top
C33  51.31,46.99 90 bottom
D1  63.5,31.5 0 top
D2  68.07,32.26 0 top
D4  78.74,23.11 90 top
J1  59.44,13.72 90 top
J2  29.21,9.91 180 top
J3  35.81,9.91 180 top
J4  40.89,22.35 180 top
J5  9.65,8.38 90 top
J6  83.57,12.45 90 top
J7  55.88,52.58 0 top
JP1  10.41,27.43 180 top
JP2  15.21,27.05 270 top
L1  35.05,15.37 270 top
L2  32.64,15.37 270 top
L3  29.97,15.37 270 top
L4  27.69,15.37 270 top
R1  63.5,33.53 180 top
R2  75.95,21.59 0 top
R3  75.95,24.38 180 top
R4  75.95,27.05 180 top
R5  30.99,30.73 180 top
R6  32.26,34.54 90 top
R7  27.94,40.89 180 bottom
R8  24.13,28.96 0 top
R9  31.5,39.62 0 top
R10  17.53,38.86 0 top
R11  17.53,40.89 0 top
R12  17.53,42.93 0 top
R13  11.18,8.38 90 bottom
R14  8.38,15.54 90 bottom
R15  13.46,17.78 180 bottom
R16  13.46,19.56 0 bottom
R17  6.35,15.75 270 bottom
R18  57.15,21.59 180 top
R19  19.3,53.34 0 bottom
R20  19.3,49.02 0 bottom
R21  19.3,46.99 0 bottom
R22  19.3,51.31 0 bottom
R23  47.5,46.99 270 bottom
R25  53.47,46.99 90 bottom
R26  49.28,46.99 90 bottom
S1  77.98,37.08 270 top
S2  19.56,9.65 180 top
S3  19.56,16.26 180 top
S4  23.11,50.55 90 top
S5  73.41,46.48 0 top
S6  67.82,46.48 0 top
S7  61.98,46.48 0 top
S8  50.04,46.48 0 top
S9  55.63,46.48 0 top
U1  46.99,33.02 270 top
U2  68.07,34.8 90 top
U3  72.39,27.18 180 top
U$1  31.37,43.94 90 top
U$2  [2,8]  75.95,53.85 0 top
U$3  25.91,35.05 0 top
U$4  31.24,21.08 180 top
U$5  [2,8]  5.33,53.85 0 top
U$6  [2,8]  5.33,4.06 0 top
U$7  [2,8]  75.95,4.06 0 top
Y1  35.05,34.8 90 top
Y2  44.58,41.4 180 top

### Tracks (layer width: path | path; a pad name or v marks a point on that pad's centre or on a via)
+3V3  (via drill 0.3)  (2 unrouted)
  Top 0.254: 26.64,18.12 U$4.9 | 35.56,18.41 U$4.16 35.69,17.91 | U$3.38 24.86,37.3 | 24.86,37.3 25.15,37.59 U$3.32 25.16,40.63 25.15,40.64 25.16,44.46 | U$3.43 24.89,34.8 | 24.89,34.8 24.89,34.29 24.4,33.8 U$3.45 | 24.89,34.8 24.89,37.3 24.86,37.3 | U$3.6 25.66,29.72 R8.2 24.98,28.87 v25.15,28.7 | 66.8,33.82 U2.5 | R1.1 64.42,33.85 64.35,33.91 | C4.1 64.52,35.73 | 37.88,16.51 C16.1 38.1,16.3 | 46.53,13.16 v46.48,13.21 | 46.61,28.81 U1.20 | v33.02,40.13 32.85,40.13 R9.2 | C22.1 48.51,24.3 48.51,25.65 | U1.6 45.79,35.24 v46.23,34.8
  Top 0.305: 32.21,43.31 U$1.1 | 24.4,33.8 24.4,33.76 v24.64,33.53 | U$3.14 27.9,32.8 27.69,33.02 27.69,35.05 27.94,35.31 v28.7,35.31 U$3.19 | 47.37,37.33 U1.4
  Top 0.406: 35.56,18.41 35.56,19.05 35.05,19.56 27.43,19.56 26.8,18.92 U$4.9 25.27,16.76 | D2.A 67.06,32.26 66.8,32.51 66.8,33.82 | U2.5 64.42,33.85 | 64.35,33.91 C4.1 | 64.52,35.73 C3.+ 62.48,37.59 60.2,39.88 v56.64,39.88 | 54.86,13.72 51.56,13.72 51.05,13.21 51.05,10.41 50.55,9.91 46.99,9.91 46.53,10.36 J4.VCC 46.53,13.16 | 54.86,13.72 J1.2 | 35.69,17.91 37.08,16.51 37.88,16.51 | v38.1,14.73 38.1,16.3 | v54.36,18.03 54.36,21.08 54.86,21.59 R18.2 56.13,21.76 56.13,24.64 55.12,25.65 48.51,25.65 48.01,25.65 46.59,27.07 U1.20 | v54.36,14.99 54.36,14.22 54.86,13.72 | 46.61,28.81 v46.61,29.72 46.23,29.97 45.21,29.97 44.99,29.75 U1.18 | 25.91,45.21 31.57,45.21 U$1.3 32.88,44.59 33.27,44.2 v33.27,43.69 | 25.91,45.21 25.16,44.46 | v33.27,43.69 32.89,43.31 32.21,43.31 | v33.27,43.69 45.47,43.69 47.37,41.78 47.37,39.88 | 47.37,39.88 47.37,37.33 | S4.5 20.89,54.55 21.59,53.85 21.59,48.51 22.1,48.01 25.65,48.01 25.91,47.75 25.91,45.21 | C21.1 25.27,16.76 | 25.27,16.76 25.27,17.4 v25.15,17.53 | 47.37,39.88 v52.58,39.88 | U1.6 45.79,38.42 47.24,39.88 47.37,39.88
  Bottom 0.254: v33.27,43.69 33.27,40.39 v33.02,40.13 31.5,38.61 | 24.64,29.21 24.64,29.04 C14.1 | v46.23,34.8 46.14,35.14 C23.1
  Bottom 0.305: v24.64,33.53 24.64,29.21 v25.15,28.7 | 31.5,38.61 29.46,38.61 28.7,37.85 v28.7,35.31
  Bottom 0.406: v46.48,13.21 38.61,13.21 38.1,13.72 v38.1,14.73 | v54.36,18.03 v54.36,14.99 | v25.15,28.7 v25.15,17.53 | v52.58,39.88 v56.64,39.88
AMP-L  (via drill 0.3)
  Top 0.254: 8.13,23.37 8.89,23.87 J5.TSH | 9.14,24.38 9.14,27.18 9.4,27.43 JP1.2
  Top 0.406: 8.89,23.87 8.9,23.87 9.14,24.38 v11.68,24.38 | v16.76,24.38 C27.1
  Bottom 0.406: v11.68,24.38 v16.76,24.38
AMP-R  (1 unrouted)
  Top 0.254: 18.07,26.16 17.59,26.65 JP2.2 15.24,26.62 15.24,16.26 14.83,15.85 4.42,15.85 3.81,15.24 3.81,10.41 4.32,9.91 6.18,9.91 J5.RSH
AMP-SHDN  (via drill 0.3)
  Top 0.254: R11.2 23.88,40.89 24.16,40.61 U$3.34 24.16,38.33 v24.38,38.1 | U$4.3 33.17,23.91 v33.17,24.87 | v51.31,29.46 51.28,29.49 U1.25
  Bottom 0.254: v51.31,29.46 51.31,25.15 51.05,24.89 33.2,24.89 v33.17,24.87 33.02,25.27 33.02,26.42 24.38,35.05 v24.38,38.1
DTR
  Bottom 0.254: R23.1 47.5,52.32 47.75,52.58 J7.P$1
GBUF  (via drill 0.3)  (1 unrouted)
  Top 0.254: J5.SLEEVE 13.1,9.8 v12.95,9.65 | v20.57,35.31 U$3.42 | C26.1 v18.2,21.08 C25.1 16.76,20.07 16.26,19.56 16.26,13.94 J5.SLEEVE | 13.21,10.89 J5.SLEEVE
  Bottom 0.254: v12.95,9.65 11.26,9.65 R13.2 | v20.57,35.31 20.32,35.05 20.32,21.59 19.81,21.08 v18.2,21.08
GND  (via drill 0.3)  (3 unrouted)
  Top 0.254: U$3.4 24.66,31.98 24.38,32.26 23.62,32.26 v23.37,32.51 23.08,32.8 U$3.47 | U$3.16 29.1,33.8 v28.57,33.78 | U$3.40 23.13,36.3 v23.37,36.07 23.1,35.8 U$3.41 | U$3.35 23.66,38.14 23.62,38.1 | U1.5 46.59,36.21 46.99,35.81 47.75,35.81 | U1.3 48.26,37.24 48.26,36.07 48.01,35.81 47.75,35.81 | v47.75,35.31 47.75,35.81
  Top 0.305: S3.3 21.78,16.57 v21.84,16.51
  Bottom 0.254: C23.2 47.84,35.39 v47.75,35.31
  Bottom 0.305: v21.84,16.51 25.65,16.51
  other vias: 50.8,14.99 46.48,14.48 44.2,9.65 37.34,39.62 8.89,21.84 3.05,19.05 27.56,36.58 12.83,35.31 21.34,21.59 67.06,43.43 22.99,52.07 37.59,37.08 50.29,43.18 27.43,44.45 31.75,29.46 22.1,24.64 6.73,46.74 37.46,50.8 44.58,53.59 12.32,3.81 45.59,4.06 64.14,5.33 62.86,24.38 57.28,26.42 53.72,29.46 17.91,29.72 9.27,30.48 6.22,34.29 14.1,22.86 13.59,13.46 28.32,12.19 34.16,11.68
  pour Top: -1.27,69.09 89.92,69.09 89.41,-7.87 -1.78,-7.87
  pour Bottom: -5.33,66.04 84.58,66.04 84.84,-5.08 -5.08,-5.08
GPIO0
  Top 0.254: R12.2 24.13,42.93 24.64,42.42 24.64,39.32 U$3.33
LEFT  (via drill 0.3)
  Top 0.254: v11.68,20.57 12.18,20.08 J5.TIP 13.1,27.43 | 13.1,27.43 13.1,32.91 13.46,33.27 19.81,33.27 | 19.81,33.27 21.63,33.27 U$3.46 | JP1.1 13.1,27.43 | U1.22 48.26,28.73 v48.26,27.43 | v34.54,25.65 24.38,25.65 v24.13,25.4 | v21.08,30.99 19.81,32.26 19.81,33.27
  Bottom 0.254: v11.68,20.57 11.68,19.81 11.94,19.56 R16.2 | v48.26,27.43 48.26,25.91 48.01,25.65 v34.54,25.65 | v24.13,25.4 23.88,25.65 21.59,25.65 21.08,26.16 v21.08,30.99
MISO  (via drill 0.3)
  Top 0.254: U$3.30 26.16,41.65 26.42,41.91 39.62,41.91 40.13,41.4 40.13,32 v40.39,31.75 | v54.1,10.41 53.34,10.41 53.09,10.16 53.09,9.14 52.07,8.13 43.69,8.13 43.23,8.58 J4.DO 43.23,13.66 40.64,16.26 v40.64,26.42 | v40.64,30.23 U1.16
  Bottom 0.254: v54.1,10.41 58.67,10.41 59.31,11.05 J1.1 | v40.39,31.75 40.39,30.48 v40.64,30.23 v40.64,26.42
MOSI  (via drill 0.3)
  Top 0.254: J4.DI 47.63,16.25 | 47.63,16.25 45.72,18.03 45.72,24.13 44.45,25.4 v44.45,26.67 | U$3.29 26.66,41.14 26.92,41.4 39.12,41.4 39.62,40.89 39.62,31.5 40.13,30.99 42.66,30.99 U1.15 43.66,31.02 v43.69,30.99 | 47.63,16.25 48.79,16.26 J1.4
  Bottom 0.254: v44.45,26.67 44.45,30.23 v43.69,30.99
MP3-CS  (via drill 0.3)
  Top 0.254: U$3.23 31.46,37.3 32.51,38.35 v38.35,38.35 | v41.53,36.58 41.53,35.43 41.91,35.05 42.66,35.05 U1.10
  Bottom 0.254: v38.35,38.35 39.88,38.35 41.53,36.7 v41.53,36.58
MP3-DCS  (via drill 0.3)
  Top 0.254: U$3.13 32.72,32.3 33.02,32 33.02,29.97 v33.27,29.72 | U1.11 42.23,34.22 41.83,34.24 41.6,34.47 v41.33,34.47
  Bottom 0.254: v41.33,34.47 41.33,34.42 41.12,34.21 37.9,34.21 37.34,33.78 37.34,29.97 37.08,29.72 v33.27,29.72
MP3-DREQ  (via drill 0.3)
  Top 0.254: U$3.8 26.66,29.73 27.94,28.45 37.34,28.45 v37.59,28.7 | U1.32 49.79,35.82 43.18,29.21 v39.88,29.21
  Bottom 0.254: v39.88,29.21 38.1,29.21 v37.59,28.7
MP3-MIDI-RX
  Top 0.254: U$3.26 28.16,40.1 28.32,40.26 30.01,40.26 R9.1
MP3-RST  (via drill 0.3)
  Top 0.254: U$3.3 24.16,29.83 R8.1 23.28,28.28 23.62,27.94 37.85,27.94 38.35,28.45 v38.35,29.97 | v41.38,33.4 42.68,33.4 U1.12
  Bottom 0.254: v38.35,29.97 38.35,33.2 38.56,33.4 v41.38,33.4
N$1
  Top 0.254: R2.2 78.09,21.59 D4.A
N$2
  Top 0.254: U2.4 66.99,35.75 67.56,36.32 67.56,38.52 C2.1
N$3
  Top 0.254: R1.2 62.62,33.5 D1.A
N$4
  Top 0.254: U3.5 73.34,24.7 73.66,24.38 R3.2 R4.2
N$5
  Top 0.254: U1.7 44.99,38.33 44.98,38.34 44.98,39.62 45.78,40.39
N$6
  Top 0.254: U$3.9 27.16,29.97 27.66,29.97 | U$3.10 27.66,29.97 | U$3.11 28.16,29.97 28.66,29.97 | 27.66,29.97 28.66,29.97 | U$3.12 28.66,29.97 | R5.2 29.38,29.97 28.66,29.97
N$7
  Top 0.254: D4.C 78.74,28.19 78.49,28.45 73.37,28.45 U3.1
N$8
  Top 0.254: U1.8 44.19,38.3 44.2,38.31 44.2,39.62 43.38,40.39
N$9
  Top 0.254: L1.1 34.91,16.01 34.42,16.51 U$4.15
N$10
  Top 0.254: L2.1 32.65,16.01 33.15,16.51 U$4.14
N$11
  Top 0.254: L3.1 29.83,16.01 29.34,16.51 U$4.11
N$12
  Top 0.254: L4.1 27.7,16.01 28.07,16.38 U$4.10
N$13
  Bottom 0.254: R15.1 C28.1
N$14  (via drill 0.3)
  Top 0.254: U$3.25 29.14,39.3 v29.21,39.37
  Bottom 0.254: v29.21,39.37 29.21,40.47 R7.2
N$15
  Top 0.254: U$3.36 18.82,39.3 R10.2
N$16
  Bottom 0.254: R14.1 C29.1
N$17
  Top 0.254: U$3.18 31.67,34.8 R6.2 33.11,35.39 33.53,35.81 | 33.53,35.81 33.53,36.27 Y1.3 | 33.53,35.81 34.29,35.81 34.8,35.31 37.68,35.31 C9.2
N$18
  Top 0.254: U$3.17 30.98,34.3 31.5,33.78 32.17,33.78 R6.1 33.11,34.54 35.05,34.54 36.2,33.39 Y1.1 36.2,31.03 C10.2
N$19
  Bottom 0.254: R13.1 C30.1
N$20
  Bottom 0.254: R16.1 R15.2
N$21
  Top 0.254: U$3.44 19.15,34.3 C12.1
N$22
  Bottom 0.254: R17.1 R14.2
N$24
  Top 0.254: C24.2 35.18,26.29 35.56,25.91 35.56,24.01 U$4.1
N$26
  Bottom 0.254: C33.1 R26.1 R23.2
N$29
  Bottom 0.254: S4.4 16.48,52.55 17.27,53.34 R19.2
N$30
  Bottom 0.254: S4.2 16.62,48.63 17.02,49.02 R20.2
N$31
  Bottom 0.254: S4.1 16.62,46.59 17.02,46.99 R21.2
N$34
  Top 0.254: U$4.2 34.42,22.23 34.04,21.84 22.61,21.84 22.1,21.34 22.1,20.32 21.84,20.07 C25.2
N$35
  Top 0.254: U$4.7 28.07,22.99 27.69,22.61 20.28,22.61 C26.2
N$42
  Top 0.254: U$4.8 20.4,23.88 C27.2
N$43  (via drill 0.3)
  Top 0.254: v29.72,21.08 23.37,21.08 22.81,20.52 22.81,14.68 22.61,14.48 21.81,14.48 | v30.23,22.86 30.23,23.25 U$4.5 | S3.1 17.5,14.51 17.53,14.48 21.81,14.48 | 21.81,14.48 S3.4
  Bottom 0.254: v29.72,21.08 30.23,21.59 v30.23,22.86
N$44  (via drill 0.3)
  Top 0.254: v31.5,22.86 31.5,23.25 U$4.4 | S2.1 S2.4 21.81,7.87 23.62,7.87 23.88,8.13 23.88,20.07 24.13,20.32 v31.24,20.32
  Bottom 0.254: v31.24,20.32 31.5,20.83 v31.5,22.86
N$45
  Top 0.254: D2.C 69.09,32.26 | 69.34,33.82 U2.1
  Top 0.406: S1.1 75.91,39.33 75.44,38.86 73.37,38.83 72.64,38.1 72.64,37.21 C1.A 71.88,37.08 71.37,36.58 71.37,35.81 | U2.1 70.68,33.85 71.37,34.54 71.37,35.81 | U2.3 71.31,35.75 71.37,35.81 | 69.09,32.26 69.34,32.51 69.34,33.82
RIGHT  (via drill 0.3)
  Top 0.254: J5.RING 5.86,12.68 v4.83,13.72 | v15.24,32.26 15.21,32.23 JP2.1 45.59,27.46 45.8,27.66 U1.19 | v20.07,36.83 21.63,36.83 U$3.39
  Bottom 0.254: v4.83,13.72 4.83,14.48 | 4.83,14.48 5.33,14.99 6.26,14.99 R17.2 | v20.07,36.83 16,36.83 15.24,36.07 v15.24,32.26 7.87,32.26 7.37,31.75 7.37,21.84 4.83,19.3 4.83,14.48
ROT-A  (via drill 0.3)
  Top 0.254: U1.1 49.79,37.85 v50.29,38.35 | S4.A 30.77,47.89 C32.1 37.07,44.45 45.72,44.45 v49.02,41.15
  Bottom 0.254: v50.29,38.35 50.29,39.88 v49.02,41.15
ROT-B  (via drill 0.3)  (1 unrouted)
  Top 0.254: 30.57,53.09 33.53,53.09 C31.1 34.12,52.58 34.8,51.82 34.8,48.01 37.85,44.96 45.97,44.96 49.02,41.91 51.05,41.91 v51.31,41.66 | U1.26 50.51,31.02 v49.02,32.51
  Bottom 0.254: v49.02,32.51 49.02,35.05 51.31,37.34 v51.31,41.66
ROT-LEDB  (via drill 0.3)
  Top 0.254: v42.42,39.37 42.7,39.09 U1.9
  Bottom 0.254: R19.1 25.15,53.34 28.7,56.9 40.64,56.9 42.42,55.12 v42.42,39.37
ROT-LEDG  (via drill 0.3)
  Top 0.254: U1.24 49.79,29.71 v49.53,29.97
  Bottom 0.254: R20.1 22.86,49.02 29.21,55.37 39.37,55.37 40.39,54.36 40.39,38.86 49.53,30.48 v49.53,29.97
ROT-LEDR  (via drill 0.3)
  Top 0.254: U1.14 41.84,31.82 40.64,33.02 40.64,41.66 v39.37,42.93
  Bottom 0.254: R21.1 21.84,46.99 29.46,54.61 38.61,54.61 39.37,53.85 v39.37,42.93
ROT-SW  (via drill 0.3)
  Top 0.254: U1.2 48.99,38.58 v49.02,38.61
  Bottom 0.254: S4.3 16.51,50.55 17.27,51.31 R22.2 18.45,50.63 18.8,50.29 23.11,50.29 28.96,56.13 39.88,56.13 41.4,54.61 41.4,39.12 41.91,38.61 v49.02,38.61
RST  (via drill 0.3)
  Top 0.254: J1.5 59.31,21.08 | 59.31,21.08 59.31,32.89 v58.8,33.4 | 51.3,33.4 U1.29 | R18.1 58.8,21.59 59.31,21.08 | U1.29 53.99,33.42 54.36,33.78 54.36,46.99 51.05,46.99 v50.55,47.5 | v50.16,33.4 51.26,33.4 U1.29
  Bottom 0.254: v58.8,33.4 v50.16,33.4 | v50.55,47.5 50.97,47.5 C33.2
RXI
  Bottom 0.254: R25.2 53.47,49.15 53.34,49.28 52.32,49.28 52.07,49.53 J7.P$2
SCK  (via drill 0.3)
  Top 0.254: U$3.28 27.16,40.62 27.43,40.89 38.61,40.89 39.12,40.39 39.12,28.96 39.62,28.45 v42.93,28.45 43.91,28.45 U1.17 | J1.3 61.21,16.26 61.72,15.75 61.72,12.7 60.71,11.68 52.32,11.68 52.07,11.43 52.07,9.91 51.31,9.14 45.97,9.14 45.47,9.65 45.47,11.62 J4.SCLK 45.43,12.99 44.7,13.72 44.67,23.15 42.88,24.94 v42.88,26.62
  Bottom 0.254: v42.88,26.62 v42.93,28.45
SD-CS  (via drill 0.3)
  Top 0.254: U1.13 v43.88,32.62 v43.89,32.61 | v48.67,14.5 48.67,12.12 J4.CS | v45.47,26.42 46.74,25.15 46.74,19.05 48.06,17.73 v48.69,17.73
  Bottom 0.254: v43.89,32.61 44.86,32.61 45.47,32 v45.47,26.42 | v48.67,14.5 48.69,14.53 v48.69,17.73
SPKL+
  Top 0.254: L4.2 26.92,13.72 26.92,10.16 J2.P1
  Bottom 0.254: J2.P1 26.42,9.91 25.91,10.41 25.91,11.85 C17.1
SPKL-
  Top 0.254: L3.2 29.97,10.67 J2.P2
  Bottom 0.254: J2.P2 29.59,9.91 30.1,10.41 C18.1
SPKR+
  Top 0.254: L1.2 35.05,10.67 J3.P2
  Bottom 0.254: J3.P2 36.65,10.74 C20.1
SPKR-
  Top 0.254: L2.2 32.64,10.54 J3.P1
  Bottom 0.254: J3.P1 32.64,10.54 C19.1
TRIG1
  Top 0.254: U1.23 48.99,27.97 49.28,27.69 55.37,27.69 55.88,28.19 55.88,42.16 56.13,42.42 70.99,42.42 71.25,42.67 71.25,44.67 | 71.25,44.67 S5.3 | 71.25,44.67 75.56,44.67 S5.2
TRIG2
  Top 0.254: U1.27 54.93,31.82 55.37,32.26 55.37,42.67 55.63,42.93 65.41,42.93 65.66,43.18 65.66,44.67 | 65.66,44.67 S6.3 | 65.66,44.67 69.98,44.67 S6.2
TRIG3
  Top 0.254: U1.28 54.46,32.62 54.86,33.02 54.86,43.18 55.12,43.43 59.44,43.43 59.69,43.69 59.69,44.67 S7.3 S7.2
TRIG4/TXO
  Top 0.254: J7.P$3 54.61,51.31 54.1,50.8 49.28,50.8 48.77,50.29 48.77,45.69 S8.3 S8.2 52.32,44.67 52.32,43.94 52.58,43.69 53.09,43.69 53.34,43.43 53.34,35.31 53.05,35.02 U1.31
TRIG5/RXI  (via drill 0.3)
  Top 0.254: U1.30 53.52,34.22 53.85,34.54 53.85,43.91 S9.3 53.4,45.53 v53.47,45.59 | v57.78,45.59 57.78,44.8 S9.2
  Bottom 0.254: v57.78,45.59 57.4,45.97 53.85,45.97 v53.47,45.59 R25.1
VBATT
  Top 0.406: BT2.PWR@1 75.44,30.99 | 75.44,30.99 74.68,31.75 74.68,32.51 | 74.68,32.51 74.68,36.83 75.69,37.85 S1.2 | C6.1 74.68,32.51 | U3.3 71.44,29.78 71.88,30.23 74.68,30.23 75.44,30.99
VCC  (via drill 0.3)  (1 unrouted)
  Top 0.254: U$3.7 26.16,32.52 25.91,32.77 25.65,32.77 | 25.65,32.77 25.4,32.77 25.15,32.51 25.15,30.81 U$3.5 | U$3.31 25.66,37.85 | 25.66,37.85 25.66,32.77 25.65,32.77 | U$3.24 25.7,37.8 25.66,37.85 | U$1.5 27.02,43.29 | 27.02,43.29 26.02,43.29 25.65,42.93 U$3.31 | 27.02,43.29 27.02,43.09 v27.94,42.67
  Top 0.305: v26.16,28.96 26.16,29.27 U$3.7
  Bottom 0.254: v27.94,42.67 28.83,42.67 C7.+ 29.09,44.92 C8.1
  Bottom 0.305: C15.1 v26.16,28.96
VIN  (via drill 0.3)
  Top 0.61: J6.PWR 69.87,19.57 71.63,21.59 | 71.63,21.59 71.63,25.56 U3.4 69.71,27.15 C5.1 68.67,28.36 v68.58,28.45 | R2.1 71.63,21.59
  Bottom 0.61: v68.58,28.45 68.58,49.28 67.82,50.04 57.66,50.04 57.15,50.55 J7.P$4